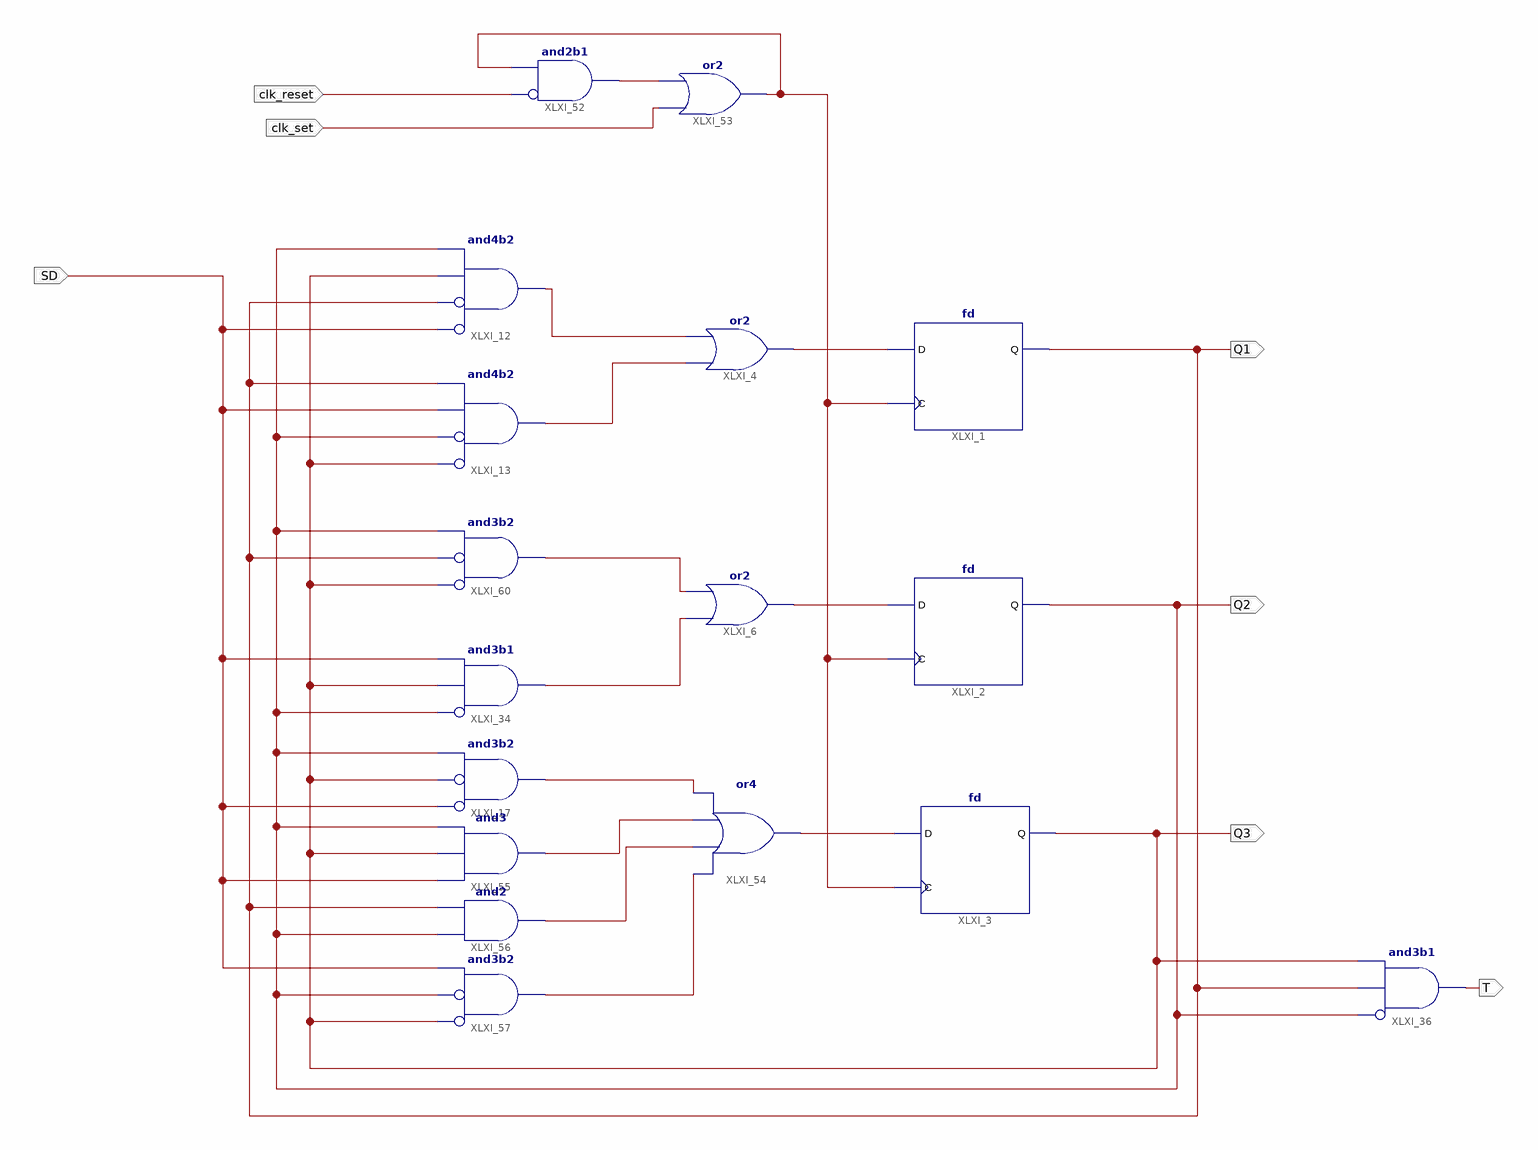
[diagram p0: schematic sheet 1]
// Xilinx ISE schematic schematic.sch (spartan6) as structural Verilog: 17 symbols, 7 ports
module schematic (
  input  clk_set,
  input  clk_reset,
  input  SD,
  output T,
  output Q1,
  output Q2,
  output Q3
);

  wire XLXN_1, XLXN_2, XLXN_3, XLXN_12, XLXN_13, XLXN_15, XLXN_40, XLXN_61, XLXN_68, XLXN_69, XLXN_70,
       XLXN_71, XLXN_81;

  fd XLXI_3 (.C(XLXN_61), .D(XLXN_3), .Q(Q3));
  or XLXI_4 (XLXN_1, XLXN_13, XLXN_12);
  and XLXI_12 (XLXN_12, ~SD, ~Q1, Q3, Q2);  // and4b2
  and XLXI_13 (XLXN_13, ~Q3, ~Q2, SD, Q1);  // and4b2
  or XLXI_6 (XLXN_2, XLXN_15, XLXN_81);
  fd XLXI_2 (.C(XLXN_61), .D(XLXN_2), .Q(Q2));
  and XLXI_17 (XLXN_68, ~SD, ~Q3, Q2);  // and3b2
  fd XLXI_1 (.C(XLXN_61), .D(XLXN_1), .Q(Q1));
  and XLXI_34 (XLXN_15, ~Q2, Q3, SD);  // and3b1
  and XLXI_36 (T, ~Q2, Q1, Q3);  // and3b1
  and XLXI_52 (XLXN_40, ~clk_reset, XLXN_61);  // and2b1
  or XLXI_53 (XLXN_61, clk_set, XLXN_40);
  or XLXI_54 (XLXN_3, XLXN_71, XLXN_70, XLXN_69, XLXN_68);
  and XLXI_55 (XLXN_69, SD, Q3, Q2);
  and XLXI_56 (XLXN_70, Q2, Q1);
  and XLXI_57 (XLXN_71, ~Q3, ~Q2, SD);  // and3b2
  and XLXI_60 (XLXN_81, ~Q3, ~Q1, Q2);  // and3b2
endmodule
